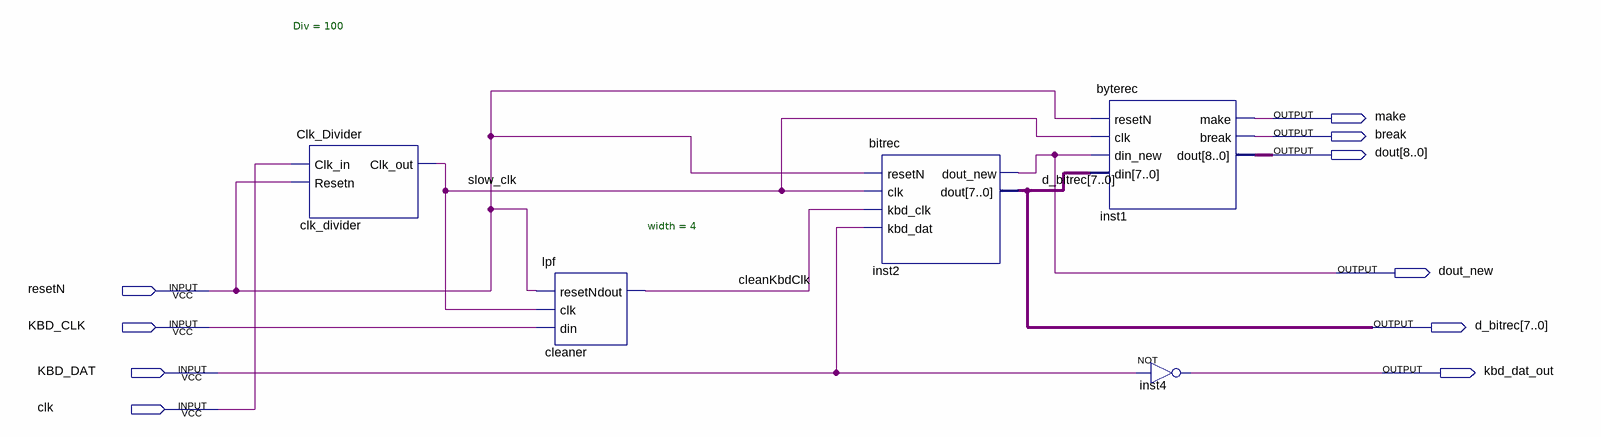
[diagram p0: schematic sheet]
// Quartus schematic KBD_NEW_UNTIL23.bdf as structural Verilog: 5 symbols, 10 pins
module KBD_NEW_UNTIL23 (
  input  resetN,
  input  KBD_CLK,
  input  KBD_DAT,
  input  clk,
  output make,
  output \break ,
  output [8:0] dout,
  output dout_new,
  output [7:0] d_bitrec,
  output kbd_dat_out
);

  wire cleanKbdClk, slow_clk;

  Clk_Divider #(.Div(100)) clk_divider (.Clk_in(clk), .Resetn(resetN), .Clk_out(slow_clk));
  lpf #(.width(4)) cleaner (.resetN(resetN), .clk(slow_clk), .din(KBD_CLK), .dout(cleanKbdClk));
  bitrec inst2 (
    .resetN(resetN), .clk(slow_clk), .kbd_clk(cleanKbdClk), .kbd_dat(KBD_DAT), .dout_new(dout_new),
    .dout(d_bitrec));
  byterec inst1 (
    .resetN(resetN), .clk(slow_clk), .din_new(dout_new), .din(d_bitrec), .make(make), .\break (\break ),
    .dout(dout));
  not inst4 (kbd_dat_out, KBD_DAT);
endmodule
